# Altium schematic sheet Phase.SchDoc
size A4; SheetNumber: 2; SheetTotal: 3
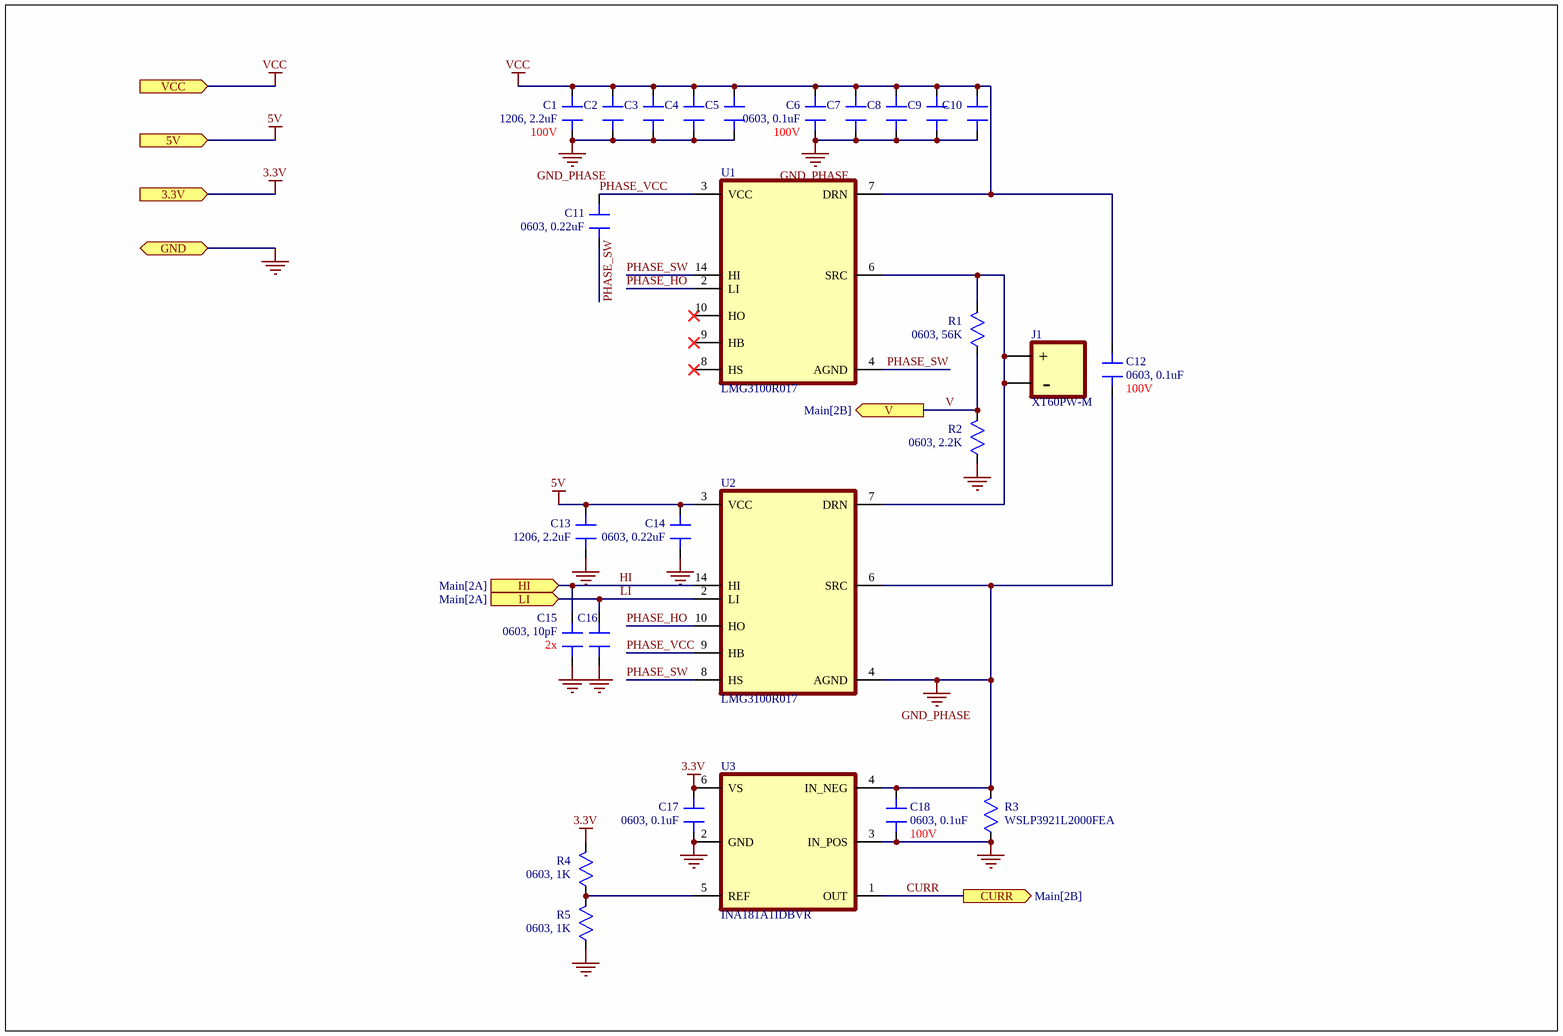
[diagram p0: Phase.SchDoc]

## Parts
C1  1206, 2.2uF  Voltage Rating: 100V  [CAP 1206_3216]
C2  1206, 2.2uF  [CAP 1206_3216]  (value not drawn)
C3  1206, 2.2uF  [CAP 1206_3216]  (value not drawn)
C4  1206, 2.2uF  [CAP 1206_3216]  (value not drawn)
C5  1206, 2.2uF  [CAP 1206_3216]  (value not drawn)
C6  0603, 0.1uF  Voltage Rating: 100V  [CAP 0603_1608]
C7  0603, 0.1uF  [CAP 0603_1608]  (value not drawn)
C8  0603, 0.1uF  [CAP 0603_1608]  (value not drawn)
C9  0603, 0.1uF  [CAP 0603_1608]  (value not drawn)
C10  0603, 0.1uF  [CAP 0603_1608]  (value not drawn)
C11  0603, 0.22uF  [CAP 0603_1608]
C12  0603, 0.1uF  Voltage Rating: 100V  [CAP 0603_1608]
C13  1206, 2.2uF  [CAP 1206_3216]
C14  0603, 0.22uF  [CAP 0603_1608]
C15  0603, 10pF  [CAP 0603_1608]
C16  0603, 10pF  [CAP 0603_1608]  (value not drawn)
C17  0603, 0.1uF  [CAP 0603_1608]
C18  0603, 0.1uF  Voltage Rating: 100V  [CAP 0603_1608]
J1  XT60PW-M  [XT60PW-M]
R1  0603, 56K  [RES 0603_1608]
R2  0603, 2.2K  [RES 0603_1608]
R3  WSLP3921L2000FEA  [WSLP3921L2000FEA]
R4  0603, 1K  [RES 0603_1608]
R5  0603, 1K  [RES 0603_1608]
U1  LMG3100R017  [LMG3100R017]
U2  LMG3100R017  [LMG3100R017]
U3  INA181A1IDBVR  [INA181A1IDBVR]

## Ports
3.3V (in, see Main[2A], Power[1C]), 5V (in, see Main[2A], Power[1C]), CURR (out, see Main[2B]), GND (bidir, see Main[2A], Power[1C]), HI (in, see Main[2A]), LI (in, see Main[2A]), V (out, see Main[2B]), VCC (in, see Main[2A], Power[1C])

## Nets
3.3V: C17.2 R4.2 U3.6(VS) ; port 3.3V
5V: C13.2 C14.2 U2.3(VCC) ; port 5V
GND: C13.1 C14.1 C15.1 C16.1 C17.1 C18.1 R2.1 R3.1 R5.1 U3.2(GND) U3.3(IN_POS) ; port GND
GND_PHASE: C1.1 C2.1 C3.1 C4.1 C5.1 C6.1 C7.1 C8.1 C9.1 C10.1 C12.1 C18.2 R3.2 U2.4(AGND) U2.6(SRC) U3.4(IN_NEG)
VCC: C1.2 C2.2 C3.2 C4.2 C5.2 C6.2 C7.2 C8.2 C9.2 C10.2 C12.2 U1.7(DRN) ; port VCC
CURR: U3.1(OUT) ; port CURR
HI: C15.2 U2.14(HI) ; port HI
LI: C16.2 U2.2(LI) ; port LI
PHASE_HO: U1.2(LI) U2.10(HO)
PHASE_SW: C11.1 U1.4(AGND) U1.14(HI) U2.8(HS)
PHASE_VCC: C11.2 U1.3(VCC) U2.9(HB)
V: R1.1 R2.2 ; port V
NetJ1_1: J1.1(+) J1.2(-) R1.2 U1.6(SRC) U2.7(DRN)
NetR4_1: R4.1 R5.2 U3.5(REF)

Not connected (* = marked no-connect by the designer): U1 8(HS)* 9(HB)* 10(HO)*

## Notes on the sheet
- (near C15) 2x

## Library data of the parts
C1 = 1206 Kapasitör
C2-C5 C13 = 1206 Kapasitör: Voltage Rating: 100V
C6 C11 C12 C14-C16 C18 = 0603 Kapasitör
C7-C10 C17 = 0603 Kapasitör: Voltage Rating: 100V
R1 R2 R4 R5 = 0603 Direnç